# EAGLE design 2017MXP board (EAGLE 7.1.0)
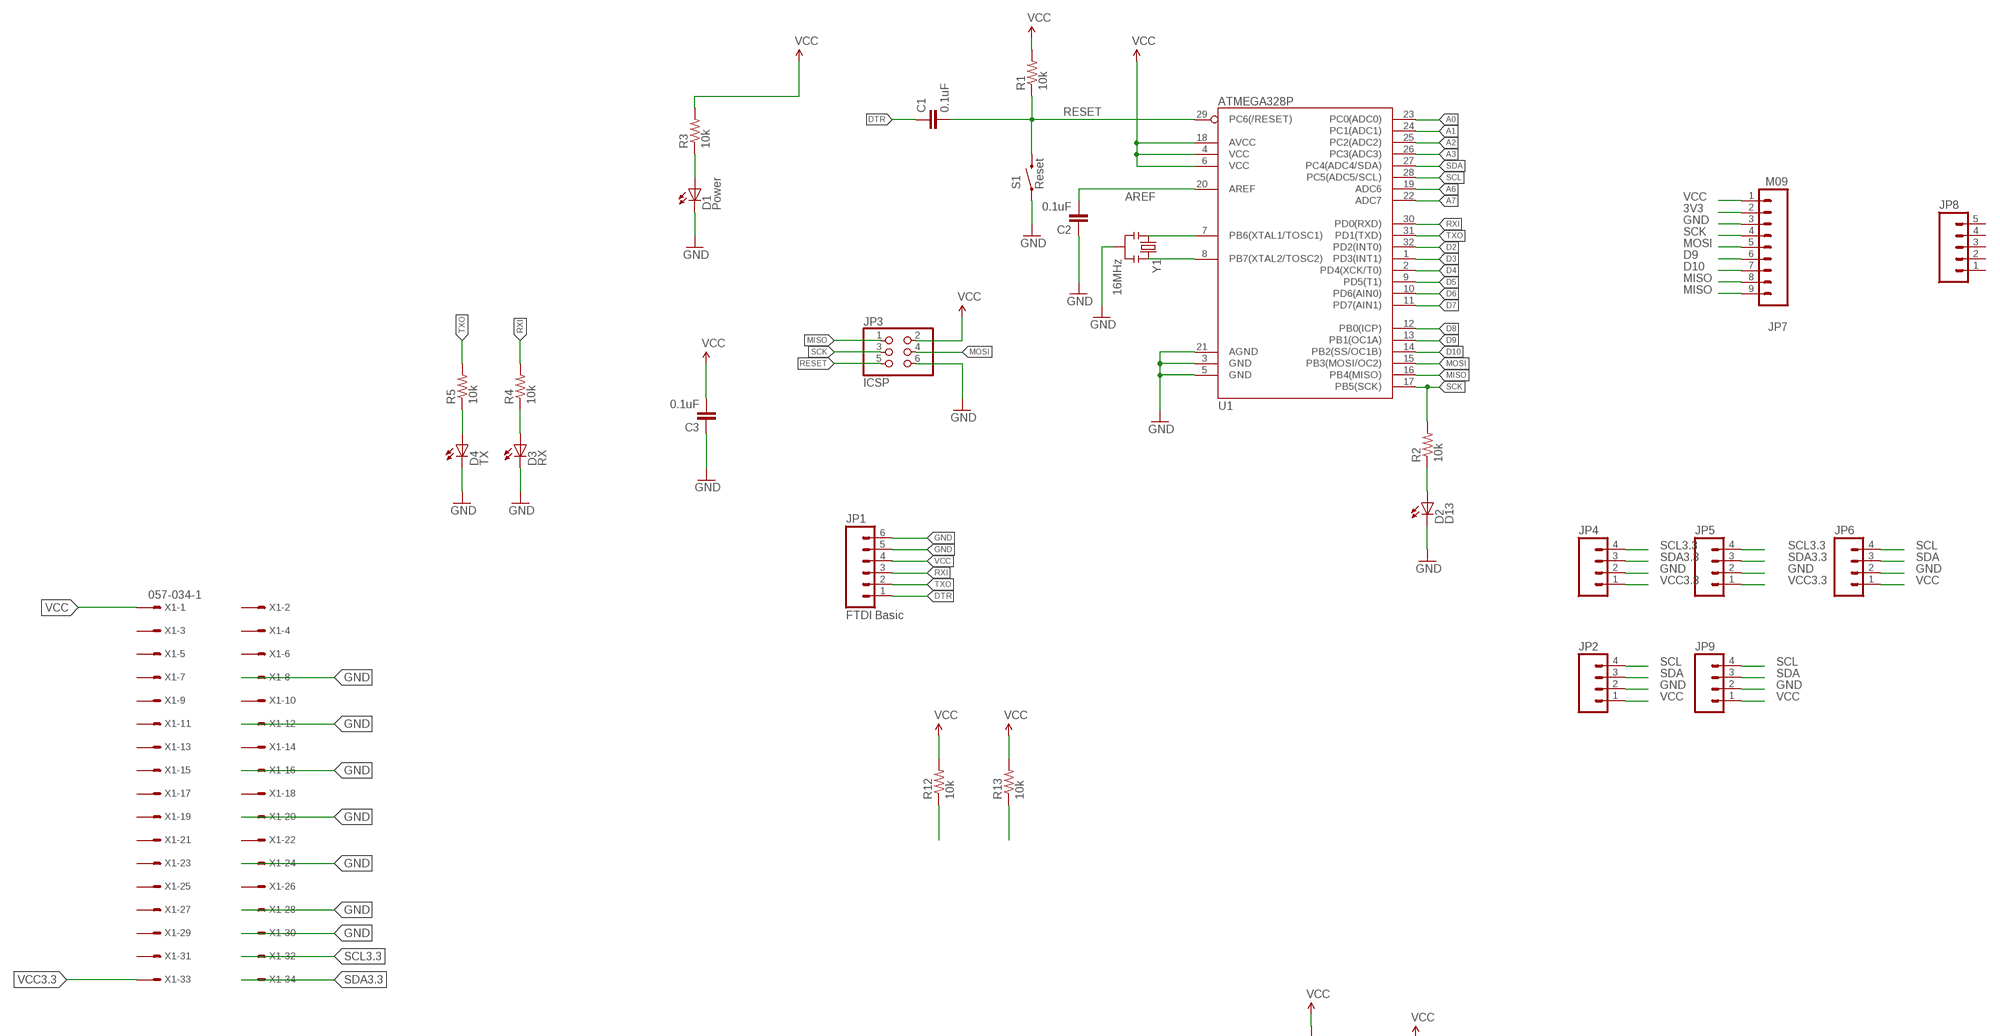
[diagram p0: schematic, sheet 1, part 1 of 2]
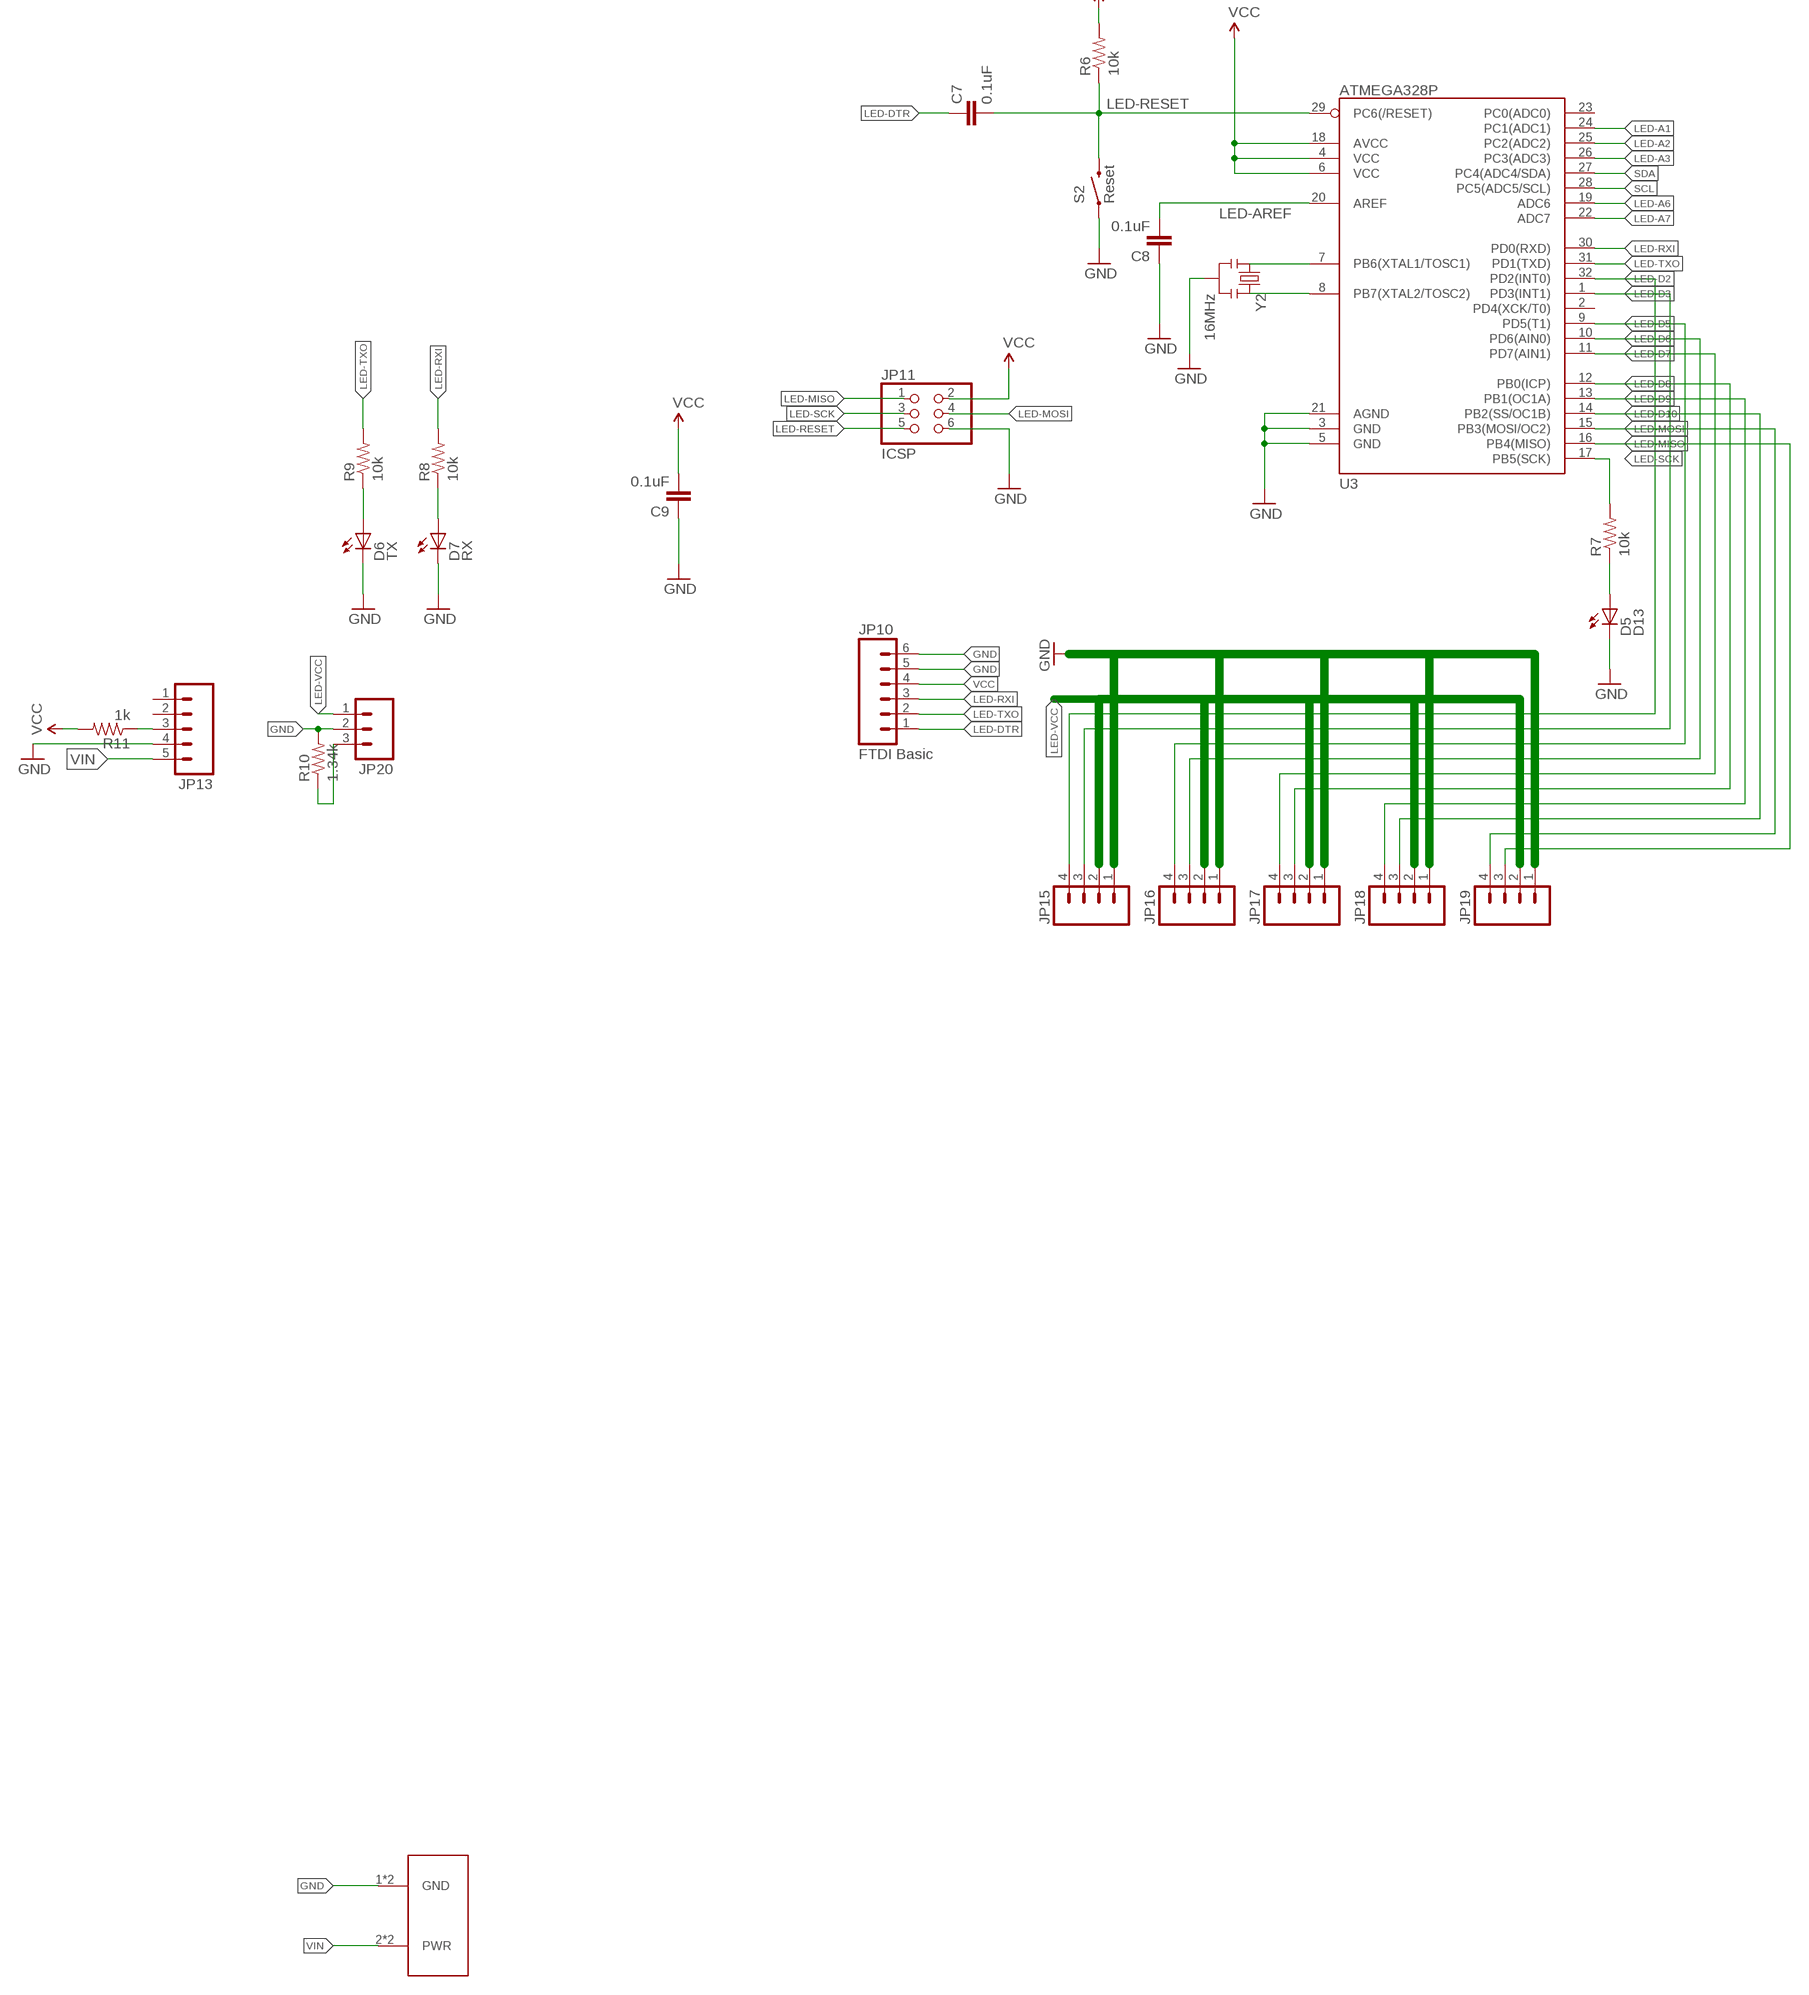
[diagram p1: schematic, sheet 1, part 2 of 2]

## Parts
C1  0.1uF  CAP0603-CAP  [0603-CAP]
C2  0.1uF  CAP0603-CAP  [0603-CAP]
C3  0.1uF  CAP0603-CAP  [0603-CAP]
C7  0.1uF  CAP0603-CAP  [0603-CAP]
C8  0.1uF  CAP0603-CAP  [0603-CAP]
C9  0.1uF  CAP0603-CAP  [0603-CAP]
D1  Power  LED-RED0603  [LED-0603]
D2  D13  LED-RED0603  [LED-0603]
D3  RX  LED-GREEN0603  [LED-0603]
D4  TX  LED-RED0603  [LED-0603]
D5  D13  LED-RED0603  [LED-0603]
D6  TX  LED-RED0603  [LED-0603]
D7  RX  LED-GREEN0603  [LED-0603]
JP1  FTDI Basic  M06SIP  [1X06]
JP2  M04PTH  [1X04]
JP3  ICSP  PINHD-2X3  [2X03]
JP4  M04PTH  [1X04]
JP5  M04PTH  [1X04]
JP6  M04PTH  [1X04]
JP7  M09  [1X09]
JP8  M05PTH  [1X05]
JP9  M04PTH  [1X04]
JP10  FTDI Basic  M06SIP  [1X06]
JP11  ICSP  PINHD-2X3  [2X03]
JP13  M05PTH  [1X05]
JP15  M04PTH  [1X04]
JP16  M04PTH  [1X04]
JP17  M04PTH  [1X04]
JP18  M04PTH  [1X04]
JP19  M04PTH  [1X04]
JP20  M03PTH  [1X03]
R1  10k  RESISTOR0603-RES  [0603-RES]
R2  10k  RESISTOR0603-RES  [0603-RES]
R3  10k  RESISTOR0603-RES  [0603-RES]
R4  10k  RESISTOR0603-RES  [0603-RES]
R5  10k  RESISTOR0603-RES  [0603-RES]
R6  10k  RESISTOR0603-RES  [0603-RES]
R7  10k  RESISTOR0603-RES  [0603-RES]
R8  10k  RESISTOR0603-RES  [0603-RES]
R9  10k  RESISTOR0603-RES  [0603-RES]
R10  1.34k  RESISTORAXIAL-0.3  [AXIAL-0.3]
R11  1k  RESISTORAXIAL-0.3  [AXIAL-0.3]
R12  10k  RESISTOR0603-RES  [0603-RES]
R13  10k  RESISTOR0603-RES  [0603-RES]
S1  Reset  SWITCH-MOMENTARY-2SMD  [TACTILE_SWITCH_SMD]
S2  Reset  SWITCH-MOMENTARY-2SMD  [TACTILE_SWITCH_SMD]
U1  ATMEGA328P  ATMEGA328_SMT  [TQFP32-08]
U3  ATMEGA328P  ATMEGA328_SMT  [TQFP32-08]
U$2  LSF-SMT  [LSF-SMT]
X1  057-034-1  [057-034-1]
Y1  16MHz  RESONATOR16MHZ  [RESONATOR-SMD]
Y2  16MHz  RESONATOR16MHZ  [RESONATOR-SMD]

## Nets
3V3: JP7.2
A0: U1.23(PC0(ADC0))
A1: U1.24(PC1(ADC1))
A2: U1.25(PC2(ADC2))
A3: U1.26(PC3(ADC3))
A6: U1.19(ADC6)
A7: U1.22(ADC7)
AREF: C2.2 U1.20(AREF)
D2: U1.32(PD2(INT0))
D3: U1.1(PD3(INT1))
D4: U1.2(PD4(XCK/T0))
D5: U1.9(PD5(T1))
D6: U1.10(PD6(AIN0))
D7: U1.11(PD7(AIN1))
D8: U1.12(PB0(ICP))
D9: JP7.6 U1.13(PB1(OC1A))
D10: JP7.7 U1.14(PB2(SS/OC1B))
DTR: C1.1 JP1.1
GND: C2.1 C3.1 C8.1 C9.1 D1.C D2.C D3.C D4.C D5.C D6.C D7.C JP1.5 JP1.6 JP2.2 JP3.6 JP4.2 JP5.2 JP6.2 JP7.3 JP9.2 JP10.5 JP10.6 JP11.6 JP13.4 JP15.1 JP16.1 JP17.1 JP18.1 JP19.1 JP20.2 R10.P$2 S1.1 S2.1 U1.3(GND) U1.5(GND) U1.21(AGND) U3.3(GND) U3.5(GND) U3.21(AGND) U$2.1(GND) U$2.1-2(GND) X1.8 X1.12 X1.16 X1.20 X1.24 X1.28 X1.30 Y1.2 Y2.2
LED-A1: U3.24(PC1(ADC1))
LED-A2: U3.25(PC2(ADC2))
LED-A3: U3.26(PC3(ADC3))
LED-A6: U3.19(ADC6)
LED-A7: U3.22(ADC7)
LED-AREF: C8.2 U3.20(AREF)
LED-D2: JP15.4 U3.32(PD2(INT0))
LED-D3: JP15.3 U3.1(PD3(INT1))
LED-D5: JP16.4 U3.9(PD5(T1))
LED-D6: JP16.3 U3.10(PD6(AIN0))
LED-D7: JP17.4 U3.11(PD7(AIN1))
LED-D8: JP17.3 U3.12(PB0(ICP))
LED-D9: JP18.4 U3.13(PB1(OC1A))
LED-D10: JP18.3 U3.14(PB2(SS/OC1B))
LED-DTR: C7.1 JP10.1
LED-MISO: JP11.1 JP19.3 U3.16(PB4(MISO))
LED-MOSI: JP11.4 JP19.4 U3.15(PB3(MOSI/OC2))
LED-RESET: C7.2 JP11.5 R6.1 S2.3 U3.29(PC6(/RESET))
LED-RXI: JP10.3 R8.2 U3.30(PD0(RXD))
LED-SCK: JP11.3 R7.2 U3.17(PB5(SCK))
LED-TXO: JP10.2 R9.2 U3.31(PD1(TXD))
LED-VCC: JP15.2 JP16.2 JP17.2 JP18.2 JP19.2 JP20.1
MISO: JP3.1 JP7.8 JP7.9 U1.16(PB4(MISO))
MOSI: JP3.4 JP7.5 U1.15(PB3(MOSI/OC2))
N$1: U1.7(PB6(XTAL1/TOSC1)) Y1.1
N$2: U1.8(PB7(XTAL2/TOSC2)) Y1.3
N$3: D1.A R3.1
N$4: D2.A R2.1
N$5: D3.A R4.1
N$6: D4.A R5.1
N$7: U3.7(PB6(XTAL1/TOSC1)) Y2.1
N$8: U3.8(PB7(XTAL2/TOSC2)) Y2.3
N$9: D5.A R7.1
N$10: D6.A R9.1
N$11: D7.A R8.1
N$12: JP20.3 R10.P$1
N$14: JP13.3 R11.P$1
RESET: C1.2 JP3.5 R1.1 S1.3 U1.29(PC6(/RESET))
RXI: JP1.3 R4.2 U1.30(PD0(RXD))
SCK: JP3.3 JP7.4 R2.2 U1.17(PB5(SCK))
SCL: JP2.4 JP6.4 JP9.4 R13.1 U1.28(PC5(ADC5/SCL)) U3.28(PC5(ADC5/SCL))
SCL3.3: JP4.4 JP5.4 X1.32
SDA: JP2.3 JP6.3 JP9.3 R12.1 U1.27(PC4(ADC4/SDA)) U3.27(PC4(ADC4/SDA))
SDA3.3: JP4.3 JP5.3 X1.34
TXO: JP1.2 R5.2 U1.31(PD1(TXD))
VCC: C3.2 C9.2 JP1.4 JP2.1 JP3.2 JP6.1 JP7.1 JP9.1 JP10.4 JP11.2 R1.2 R3.2 R6.2 R11.P$2 R12.2 R13.2 U1.4(VCC) U1.6(VCC) U1.18(AVCC) U3.4(VCC) U3.6(VCC) U3.18(AVCC) X1.1
VCC3.3: JP4.1 JP5.1 X1.33
VIN: JP13.5 U$2.2(PWR) U$2.2-2(PWR)
Unconnected: JP8.1 JP8.2 JP8.3 JP8.4 JP8.5 JP13.1 JP13.2 U3.2(PD4(XCK/T0)) U3.23(PC0(ADC0)) X1.2 X1.3 X1.4 X1.5 X1.6 X1.7 X1.9 X1.10 X1.11 X1.13 X1.14 X1.15 X1.17 X1.18 X1.19 X1.21 X1.22 X1.23 X1.25 X1.26 X1.27 X1.29 X1.31

## Library data of the parts
C1-C3 C7-C9 = SparkFun-Passives:CAP: Capacitor Standard 0603 ceramic capacitor, and 0.1" leaded capacitor.
D1 D2 D4-D6 = SparkFun-LED:LED-RED: Assorted Red LEDs LilyPad 1206- DIO-09912 1206- DIO-00809 0603- DIO-00819; PROD_ID: DIO-00819; VALUE: RED
D3 D7 = SparkFun-LED:LED-GREEN: Various green LEDs Green LEDs used in SFE Production 0603- DIO-00821 LARGE- DIO-00862 LILYPAD- DIO-09910; PROD_ID: DIO-00821; VALUE: GREEN
JP1 JP10 = SparkFun-Connectors:M06: Header 6 Standard 6-pin 0.1" header. Use with straight break away headers (SKU : PRT-00116), right angle break away headers (PRT-00553), swiss pins (PRT-00743), machine pins (PRT-00117), and female headers (PRT-00115). Molex polarized connector foot print use with SKU : PRT-08094 with associated crimp pins and housings. NOTES ON THE VARIANTS LOCK and LOCK_LONGPADS... This footprint was designed to help hold the alignment of a through-hole component (i.e. 6-pin header) while soldering it into place. You may notice that each hole has been shifted either up or down by 0.005 of an inch from it's more standard position (which is a perfectly straight line). This slight alteration caused the pins (the squares in the middle) to touch the edges of the holes. Because they are alternating, it causes a "brace" to hold the component in place. 0.005 has proven to be the perfect amount of "off-center" position when using our standard breakaway headers. Although looks a little odd when you look at the bare footprint, once you have a header in there, the alteration is very hard to notice. Also,if you push a header all the way into place, it is covered up entirely on the bottom side. This idea of altering the position of holes to aid alignment will be further integrated into the Sparkfun Library for other footprints. It can help hold any component with 3 or more connection pins.
JP2 JP4-JP6 JP9 JP15-JP19 = SparkFun-Connectors:M04: Header 4 Standard 4-pin 0.1" header. Use with straight break away headers (SKU : PRT-00116), right angle break away headers (PRT-00553), swiss pins (PRT-00743), machine pins (PRT-00117), and female headers (PRT-00115). Molex polarized connector foot print use with SKU : PRT-08231 with associated crimp pins and housings. 1MM SMD Version SKU: PRT-10208
JP3 JP11 = SparkFun-Connectors:PINHD-2X3: PIN HEADER
JP7 = SparkFun-Connectors:M09: Header 9 Standard 9-pin 0.1" header. Use with straight break away headers (SKU : PRT-00116), right angle break away headers (PRT-00553), swiss pins (PRT-00743), machine pins (PRT-00117), and female headers (PRT-00115).
JP8 JP13 = SparkFun-Connectors:M05: Header 5 Standard 5-pin 0.1" header. Use with straight break away headers (SKU : PRT-00116), right angle break away headers (PRT-00553), swiss pins (PRT-00743), machine pins (PRT-00117), and female headers (PRT-00115). Molex polarized connector foot print use with SKU : PRT-08230 with associated crimp pins and housings.
JP20 = SparkFun-Connectors:M03: Header 3 Standard 3-pin 0.1" header. Use with straight break away headers (SKU : PRT-00116), right angle break away headers (PRT-00553), swiss pins (PRT-00743), machine pins (PRT-00117), and female headers (PRT-00115). Molex polarized connector foot print use with SKU : PRT-08232 with associated crimp pins and housings.
R1-R9 R12 R13 = SparkFun-Passives:RESISTOR: Resistor Basic schematic elements and footprints for 0603, 1206, and PTH resistors.
R10 R11 = SparkFun-Resistors:RESISTOR: Resistor Basic schematic elements and footprints for 0603, 1206, and PTH resistors.
S1 S2 = SparkFun-Electromechanical:SWITCH-MOMENTARY-2: Various NO switches- pushbuttons, reed, etc; PROD_ID: SWCH-08247
U1 U3 = SparkFun-DigitalIC:ATMEGA328_SMT: 32-Pin Atmega328 part Commonly used on Arduino compatible boards Available in QFP and QFN packages TQFP is IC-09069 QFN is non-stock; PROD_ID: IC-09069
U$2 = LSF-SMT:LSF-SMT
X1 = con-panduit:057-034-: CONNECTOR 34-pin series 057 contact pc board low profile headers; OC_FARNELL: unknown; OC_NEWARK: unknown
Y1 Y2 = SparkFun-FreqCtrl:RESONATOR: Resonator Small SMD resonator. Used, eg, on the Arduino Pro/ Pro Mini boards. 8MHz- XTAL-08895 16MHz- XTAL-08900; PROD_ID: XTAL-08900

## Board
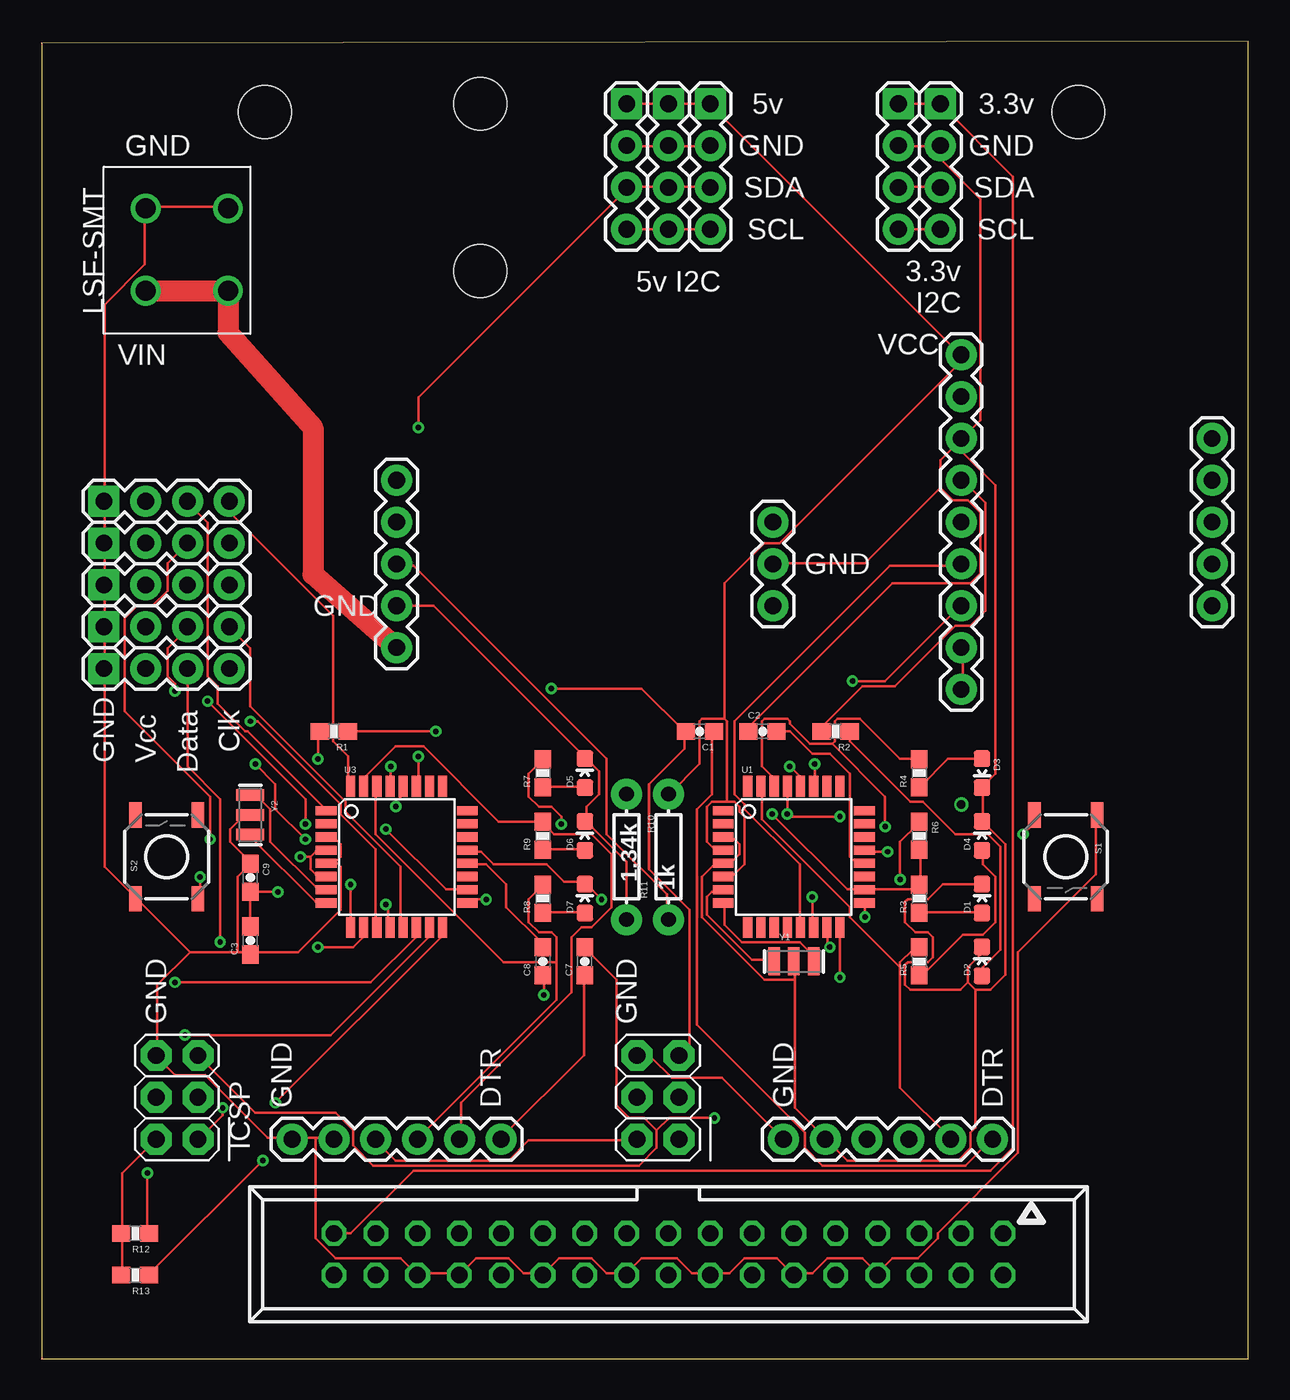
[diagram p2: board, top side]
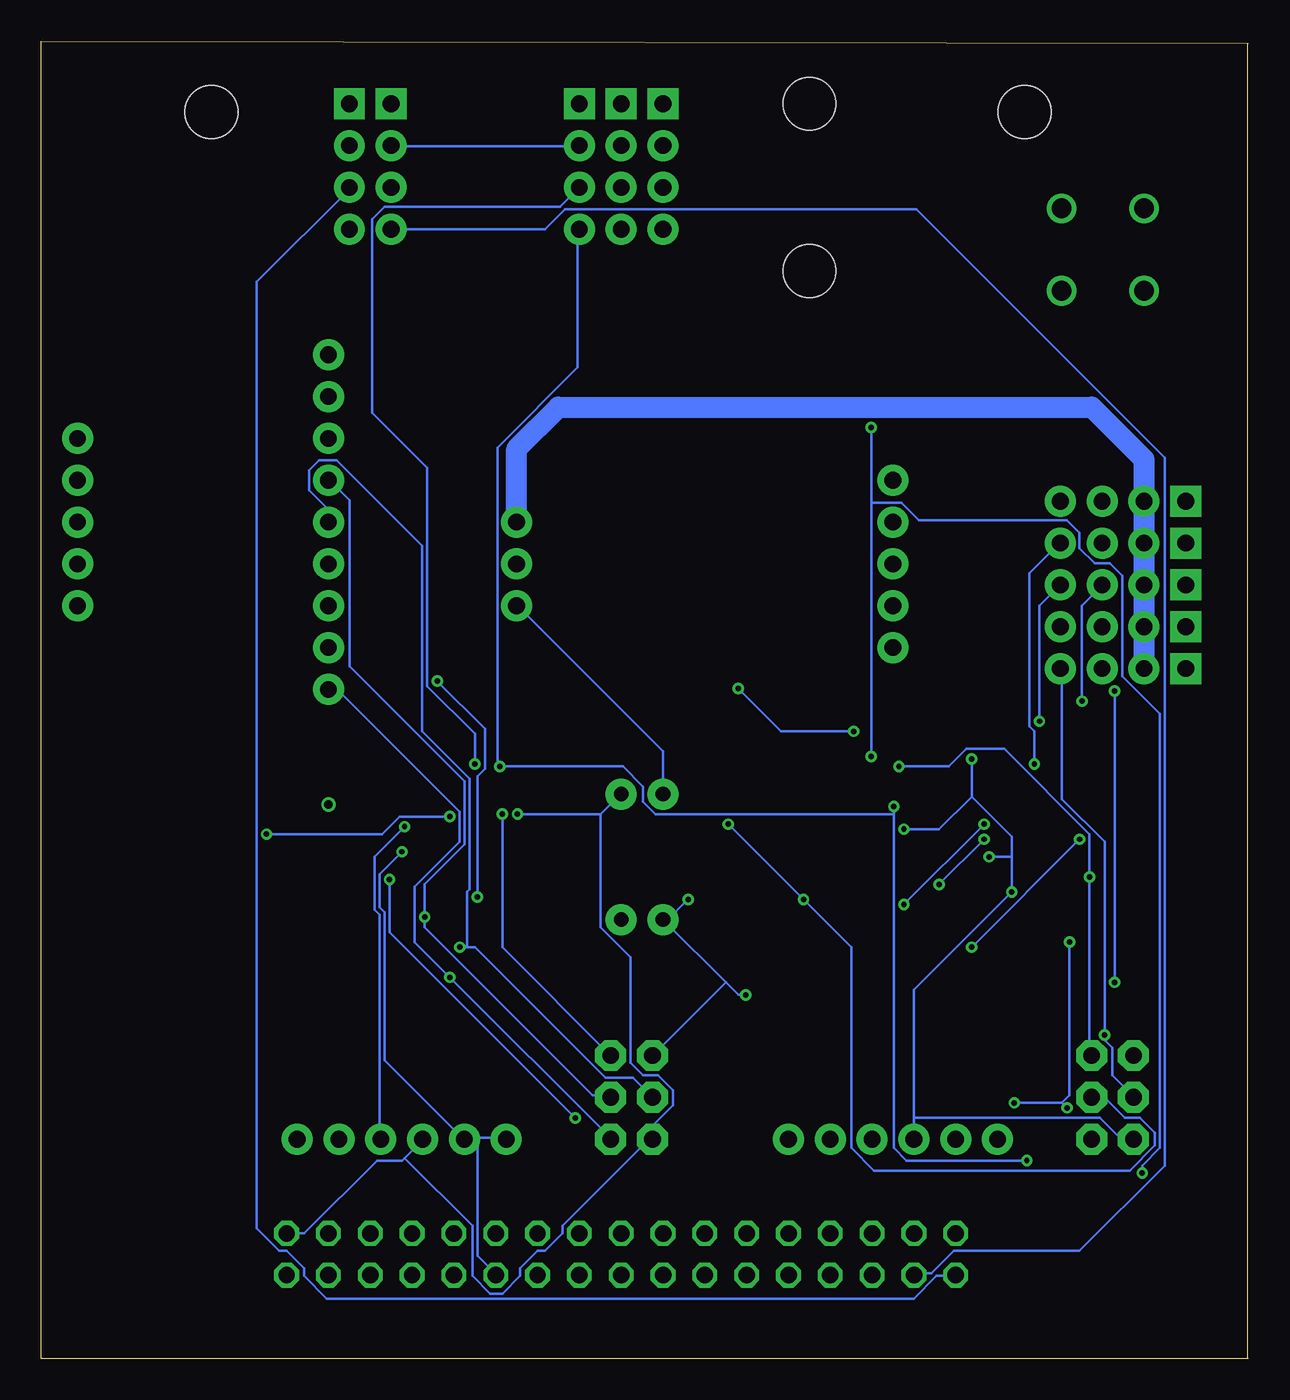
[diagram p3: board, bottom side, seen from below]

Size 73.33 x 80 mm. Coordinates in mm from the lower left corner, seen from the top.
Outline: 0,0 0.05,0
Outline: 0.05,0 73.33,0 73.33,80 0,79.87
Outline: 0.05,0 0.05,79.87
Copper layers (1*16): Top 0.0356mm / dielectric 1.5011mm / Bottom 0.0356mm
Design rules "LaenPCBOrder": minimum track width 6mil, minimum drill 13mil, track to track 6mil, track to pad 6mil, pad to pad 6mil, via to via 6mil, smd to smd 6mil, copper to edge 15mil, drill to drill 6mil, minimum pad ring 7mil, minimum via ring 7mil, stop-mask expansion 3mil, vias tented up to drill 0mil, thermal gap 10mil
Holes 3.2 mm at 13.59,75.69 62.99,75.69 26.67,66.04 26.67,76.2

### Footprints (pad centres in the part's own frame; a part is rotated, then mirrored left to right if it is on the bottom)
0603-CAP = smd 1.1 x 1: 1 -0.85,0; 2 0.85,0
LED-0603 = smd 1 x 1: A 0,-0.877; C 0,0.877
1X06 = drill 1.016 pad 1.88: 1 0,0; 2 2.54,0; 3 5.08,0; 4 7.62,0; 5 10.16,0; 6 12.7,0
1X04 = drill 1.016 pad 1.88 square: 1 0,0 | drill 1.016 pad 1.88: 2 2.54,0; 3 5.08,0; 4 7.62,0
2X03 = drill 1.016 pad 1.88 octagon: 1 -2.54,-1.27; 2 -2.54,1.27; 3 0,-1.27; 4 0,1.27; 5 2.54,-1.27; 6 2.54,1.27
1X09 = drill 1.016 pad 1.88: 1 0,0; 2 2.54,0; 3 5.08,0; 4 7.62,0; 5 10.16,0; 6 12.7,0; 7 15.24,0; 8 17.78,0; 9 20.32,0
1X05 = drill 1.016 pad 1.88: 1 0,0; 2 2.54,0; 3 5.08,0; 4 7.62,0; 5 10.16,0
1X03 = drill 1.016 pad 1.88: 1 0,0; 2 2.54,0; 3 5.08,0
0603-RES = smd 1.1 x 1: 1 -0.85,0; 2 0.85,0
AXIAL-0.3 = drill 0.9 pad 1.88: P$1 -3.81,0; P$2 3.81,0
TACTILE_SWITCH_SMD = smd 1.524 x 0.762: 1 -2.54,1.905; 2 2.54,1.905; 3 -2.54,-1.905; 4 2.54,-1.905
TQFP32-08 = smd 1.27 x 0.559: 1 -4.293,2.8; 2 -4.293,2; 3 -4.293,1.2; 4 -4.293,0.4; 5 -4.293,-0.4; 6 -4.293,-1.2; 7 -4.293,-2; 8 -4.293,-2.8; 17 4.293,-2.8; 18 4.293,-2; 19 4.293,-1.2; 20 4.293,-0.4; 21 4.293,0.4; 22 4.293,1.2; 23 4.293,2; 24 4.293,2.8 | smd 0.559 x 1.27: 9 -2.8,-4.293; 10 -2,-4.293; 11 -1.2,-4.293; 12 -0.4,-4.293; 13 0.4,-4.293; 14 1.2,-4.293; 15 2,-4.293; 16 2.8,-4.293; 25 2.8,4.293; 26 2,4.293; 27 1.2,4.293; 28 0.4,4.293; 29 -0.4,4.293; 30 -1.2,4.293; 31 -2,4.293; 32 -2.8,4.293
LSF-SMT = drill 1.199: 1 0,5.004; 1-2 0,0; 2 5.004,5.004; 2-2 5.004,0
057-034-1 = drill 1 octagon: 1 -20.32,-1.27; 2 -20.32,1.27; 3 -17.78,-1.27; 4 -17.78,1.27; 5 -15.24,-1.27; 6 -15.24,1.27; 7 -12.7,-1.27; 8 -12.7,1.27; 9 -10.16,-1.27; 10 -10.16,1.27; 11 -7.62,-1.27; 12 -7.62,1.27; 13 -5.08,-1.27; 14 -5.08,1.27; 15 -2.54,-1.27; 16 -2.54,1.27; 17 0,-1.27; 18 0,1.27; 19 2.54,-1.27; 20 2.54,1.27; 21 5.08,-1.27; 22 5.08,1.27; 23 7.62,-1.27; 24 7.62,1.27; 25 10.16,-1.27; 26 10.16,1.27; 27 12.7,-1.27; 28 12.7,1.27; 29 15.24,-1.27; 30 15.24,1.27; 31 17.78,-1.27; 32 17.78,1.27; 33 20.32,-1.27; 34 20.32,1.27
RESONATOR-SMD = smd 0.7 x 1.7: 1 -1.2,0; 2 0,0; 3 1.2,0

### Placement (x,y rotation side)
C1  40.01,38.1 180 top
C2  43.81,38.1 0 top
C3  12.7,25.4 90 top
C7  33.02,24.13 90 top
C8  30.48,24.13 90 top
C9  12.7,29.21 270 top
D1  57.15,27.94 0 top
D2  57.15,24.13 0 top
D3  57.15,35.56 180 top
D4  57.15,31.75 0 top
D5  33.02,35.56 0 top
D6  33.02,31.75 0 top
D7  33.02,27.94 0 top
JP1  57.78,13.34 180 top
JP2  35.56,76.2 270 top
JP3  37.47,15.88 90 top
JP4  54.61,76.2 270 top
JP5  52.07,76.2 270 top
JP6  40.64,76.2 270 top
JP7  55.88,60.96 270 top
JP8  71.12,55.88 270 top
JP9  38.1,76.2 270 top
JP10  27.94,13.34 180 top
JP11  8.26,15.88 90 top
JP13  21.59,53.34 270 top
JP15  3.81,52.07 0 top
JP16  3.81,49.53 0 top
JP17  3.81,46.99 0 top
JP18  3.81,44.45 0 top
JP19  3.81,41.91 0 top
JP20  44.45,50.8 270 top
R1  17.78,38.1 180 top
R2  48.26,38.1 180 top
R3  53.34,27.94 90 top
R4  53.34,35.56 90 top
R5  53.34,24.13 90 top
R6  53.34,31.75 270 top
R7  30.48,35.56 90 top
R8  30.48,27.94 90 top
R9  30.48,31.75 90 top
R10  35.56,30.48 270 top
R11  38.1,30.48 90 top
R12  5.71,7.62 180 top
R13  5.71,5.08 180 top
S1  62.23,30.48 270 top
S2  7.62,30.48 90 top
U1  45.72,30.48 0 top
U3  21.59,30.48 0 top
U$2  6.35,69.85 270 top
X1  38.1,6.35 180 top
Y1  45.72,24.13 0 top
Y2  12.7,33.02 270 top

### Tracks (layer width: path | path; a pad name or v marks a point on that pad's centre or on a via)
AREF
  Top 0.152: C2.2 45.47,38.1 46.84,36.73 47.9,36.73 49.12,35.51 49.12,30.48 49.43,30.18 49.89,30.18 U1.20
D9
  Top 0.152: U1.13 46.08,26.21 46.08,30.02 42.72,33.38 42.72,33.68 42.11,34.29 42.11,38.71 51.56,48.16 55.83,48.16 JP7.6
D10  (via drill 0.33)
  Top 0.152: v46.84,28.04 46.84,26.21 U1.14 | v49.28,41.15 51.26,41.15 55.83,45.72 JP7.7
  Bottom 0.152: v46.84,28.04 46.84,35.36 46.38,35.81 46.38,38.25 v49.28,41.15
DTR
  Top 0.152: C1.1 40.74,38.1 40.74,34.29 39.83,33.38 39.83,20.27 46.38,13.72 46.38,12.8 47.45,11.73 56.13,11.73 57.66,13.26 JP1.1
GND  (via drill 0.33)
  Top 0.152: 54.61,73.61 52.17,73.61 JP5.2 | JP2.2 35.56,73.61 38,73.61 JP9.2 38.15,73.61 40.59,73.61 JP6.2 | 54.61,52.88 55.37,52.12 56.29,52.12 57.05,51.36 57.05,47.7 56.44,47.09 51.71,47.09 43.03,38.41 43.03,38.1 C2.1 | 54.61,52.88 54.61,54.56 55.52,55.47 | 55.52,55.47 55.83,55.78 JP7.3 | 54.61,52.88 50.04,48.31 44.55,48.31 JP20.2 | 54.61,73.61 54.61,72.85 57.05,70.41 57.05,57 55.98,55.93 JP7.3 | 54.61,73.61 JP4.2 | U$2.1 11.33,69.95 6.45,69.95 U$2.1-2 6.3,69.8 6.3,66.45 3.86,64.01 3.86,52.12 JP15.1 3.86,51.97 3.86,49.53 | 17.88,30.18 17.42,30.18 U3.5 17.88,30.18 | 17.88,30.18 18.19,30.48 18.19,31.24 17.88,31.55 17.42,31.55 U3.3 | 3.86,41.91 3.86,44.35 JP18.1 3.86,44.5 3.86,46.94 JP17.1 3.86,47.09 3.86,49.53 | 3.86,49.53 JP16.1 | U3.21 25.96,30.79 26.72,30.79 27.48,30.02 30.68,30.02 31.75,28.96 32.97,28.96 D7.C 33.12,28.8 v34.04,27.89 | v30.53,22.1 30.53,23.16 C8.1 | R10.P$2 35.56,30.18 33.12,32.61 D6.C 33.12,32.77 33.12,33.53 33.88,34.29 33.88,35.66 33.12,36.42 D5.C 32.97,36.58 23.83,45.72 JP13.4 | 56.29,22.86 56.29,23.77 57.05,24.54 57.05,24.99 D2.C | 56.74,22.4 56.29,22.86 | 56.74,22.4 57.66,22.4 58.57,23.32 58.57,31.24 57.2,32.61 D4.C 57.2,32.77 57.2,34.59 D3.C 57.2,34.75 57.96,35.51 57.96,53.03 55.52,55.47 | 56.29,22.86 55.83,22.4 52.78,22.4 52.48,22.71 52.48,23.93 52.63,24.08 53.85,24.08 54.15,24.38 54.15,25.6 53.85,25.91 53.09,25.91 52.48,26.52 52.48,27.74 52.63,27.89 53.85,27.89 54.76,28.8 57.05,28.8 D1.C | U1.3 41.5,31.55 42.11,31.55 42.42,31.24 42.42,30.63 41.96,30.18 41.5,30.18 U1.5 41.35,30.02 40.89,30.02 40.13,29.26 40.13,26.82 43.94,23.01 45.77,23.01
  Top 0.152: v51.41,30.79 50.04,30.79 U1.21 | 45.77,23.01 45.77,15.24 47.6,13.41 JP1.5 47.75,13.26 48.97,12.04 55.68,12.04 56.44,12.8 56.44,13.72 56.74,14.02 56.74,22.4 | 45.77,23.01 45.77,24.08 Y1.2 | 16.66,13.41 17.73,13.41 JP10.5 | 16.66,13.41 15.29,13.41 JP10.6 15.14,13.41 13.77,13.41 9.96,17.22 8.13,17.22 7.06,18.29 JP11.6 7.06,18.44 7.06,22.71 9.04,24.69 | 9.04,24.69 11.94,24.69 | 11.94,24.69 12.7,24.69 | 9.04,24.69 5.84,27.89 S2.1 5.69,28.04 3.86,29.87 3.86,41.91 | 35.56,5.18 34.34,5.18 33.43,6.1 31.45,6.1 30.53,5.18 X1.24 30.38,5.18 29.31,5.18 28.4,6.1 26.42,6.1 X1.28 25.35,5.18 22.91,5.18 X1.30 21.84,6.1 17.88,6.1 16.66,7.32 16.66,13.41 | 35.56,5.18 36.47,6.1 38.61,6.1 39.52,5.18 40.59,5.18 X1.16 40.74,5.18 41.81,5.18 42.72,6.1 44.7,6.1 X1.12 45.77,5.18 46.84,5.18 47.75,6.1 49.89,6.1 50.8,5.18 | 35.56,5.18 X1.20 | 50.8,5.18 51.71,6.1 53.24,6.1 54.46,7.32 54.46,7.62 59.33,12.5 59.33,24.69 64.06,29.41 64.06,32.92 S1.1 | 50.8,5.18 X1.8 | JP1.6 41.35,17.07 38.3,17.07 37.08,18.29 36.32,18.29 JP3.6 | 3.86,41.91 JP19.1 | 55.52,55.47 JP7.3 | Y2.2 12.7,32.92 12.24,32.92 11.48,32.16 11.48,31.39 12.7,30.18 C9.1 12.7,30.02 11.94,29.26 11.94,24.69 | 17.88,30.18 18.19,29.87 18.19,27.28 15.6,24.69 12.7,24.69 | 12.7,24.69 C3.1
  Bottom 0.152: JP5.2 52.02,73.61 40.74,73.61 JP6.2 | v30.53,22.1 30.99,22.1 31.75,22.86 | 35.41,26.52 31.75,22.86 | 31.75,22.86 JP3.6 | 35.41,26.52 v34.04,27.89 | 35.41,26.52 R10.P$2 | v51.41,30.79 52.78,29.41 52.78,27.43 52.48,27.13 52.48,18.14 47.75,13.41 JP1.5 | 46.84,13.41 47.6,13.41 JP1.5 | 46.84,13.41 45.16,13.41 JP1.6 | 46.84,13.41 46.84,6.25 45.77,5.18 X1.12 | 46.84,13.41 JP1.5
LED-AREF
  Top 0.152: C8.2 30.38,24.99 30.38,25.3 28.25,27.43 28.25,28.8 27.03,30.02 25.96,30.02 U3.20
LED-D2
  Top 0.152: U3.32 18.64,34.9 18.64,36.58 17.73,37.49 17.73,45.11 11.48,51.36 11.48,51.97 JP15.4
LED-D3
  Top 0.152: U3.1 17.27,33.38 12.55,38.1 12.39,38.1 10.72,39.78 10.72,40.84 10.11,41.45 10.11,50.75 8.89,51.97 JP15.3
LED-D5  (via drill 0.33)
  Top 0.152: v18.8,28.8 18.8,26.21 U3.9 | v16.05,31.55 14.22,33.38 14.22,34.9 v13.01,36.12
  Bottom 0.152: v16.05,31.55 v18.8,28.8 | v13.01,36.12 13.01,38.1 13.31,38.41 13.31,47.7 11.48,49.53 JP16.4
LED-D6  (via drill 0.33)
  Top 0.152: v16.81,24.99 18.95,24.99 19.56,25.6 19.56,26.06 U3.10 | v10.26,31.55 10.26,34.14 5.08,39.32 5.08,44.96 5.84,45.72 6.76,45.72 7.67,46.63 7.67,48.31 JP16.3
  Bottom 0.152: v10.26,31.55 v16.81,24.99
LED-D7  (via drill 0.33)
  Top 0.152: v12.7,38.71 13.16,38.71 18.19,33.68 18.19,33.07 20.32,30.94 20.32,26.21 U3.11
  Bottom 0.152: v12.7,38.71 12.7,45.72 JP17.4
LED-D8  (via drill 0.33)
  Top 0.152: v20.93,27.58 21.08,27.43 21.08,26.21 U3.12 | v16.05,32.46 16.05,33.98 v10.11,39.93
  Bottom 0.152: v16.05,32.46 v20.93,27.58 | v10.11,39.93 10.11,45.72 8.89,46.94 JP17.3
LED-D9
  Top 0.152: U3.13 21.84,26.21 21.84,29.87 18.49,33.22 18.49,33.83 12.7,39.62 12.7,43.13 11.48,44.35 JP18.4
LED-D10  (via drill 0.33)
  Top 0.152: v8.13,22.86 20.02,22.86 22.76,25.6 22.76,26.06 U3.14 | v8.13,40.54 8.13,41 7.67,41.45 7.67,43.13 8.89,44.35 JP18.3
  Bottom 0.152: v8.13,40.54 v8.13,22.86
LED-DTR
  Top 0.152: C7.1 32.97,23.16 32.97,18.44 27.94,13.41 JP10.1
LED-MISO  (via drill 0.33)
  Top 0.152: v14.22,15.54 24.28,25.6 24.28,26.06 U3.16 | v11.02,15.24 11.02,14.78 9.65,13.41 JP11.1 | JP19.3 8.89,35.97 10.87,33.98 v10.87,25.3
  Bottom 0.152: 11.33,15.54 v14.22,15.54 | v11.02,15.24 11.33,15.54 | v10.87,25.3 10.87,16 11.33,15.54
LED-MOSI  (via drill 0.33)
  Top 0.152: v8.74,19.66 17.58,19.66 23.52,25.6 23.52,26.06 U3.15
  Bottom 0.152: JP11.4 7.06,16 8.28,17.22 8.28,18.9 8.74,19.36 v8.74,19.66 8.74,31.39 11.33,33.98 11.33,41.91 JP19.4
LED-RESET  (via drill 0.33)
  Top 0.152: 37.39,13.87 36.63,14.63 35.71,14.63 34.95,15.39 34.95,23.01 33.12,24.84 C7.2 | 37.39,13.87 37.39,12.8 36.32,11.73 20.17,11.73 18.95,12.95 18.95,13.87 17.88,14.94 13.01,14.94 JP11.5 | v52.17,29.11 52.17,31.39 53.24,32.46 R6.1 | v40.89,14.63 38.15,14.63 37.39,13.87 | v21.23,35.97 21.23,34.9 U3.29 | v9.65,29.26 9.65,28.04 S2.3
  Bottom 0.152: v52.17,29.11 52.17,25.91 v40.89,14.63 | v21.23,35.97 18.19,35.97 17.12,37.03 14.83,37.03 9.65,31.85 v9.65,29.26 9.65,18.44 JP11.5
LED-RXI
  Top 0.152: 31.29,24.08 31.29,21.79 22.91,13.41 JP10.3 | 31.29,24.08 31.29,25.6 30.99,25.91 30.23,25.91 29.62,26.52 29.62,27.89 30.38,28.65 R8.2 | 31.29,24.08 28.09,24.08 20.32,31.85 20.32,34.75 U3.30
LED-SCK  (via drill 0.33)
  Top 0.152: v31.6,32.46 31.6,32.92 30.99,33.53 30.23,33.53 29.62,34.14 29.62,35.51 30.38,36.27 R7.2 | v27.03,27.89 26.11,27.89 25.96,27.74 U3.17
  Bottom 0.152: v31.6,32.46 v27.03,27.89 24.13,24.99 24.13,12.8 22.76,11.43 7.21,11.43 5.69,12.95 5.69,13.72 6.6,14.63 7.52,14.63 8.74,15.85 9.5,15.85 JP11.3
LED-TXO
  Top 0.152: U3.31 19.71,34.9 19.71,35.36 21.54,37.19 23.22,37.19 27.79,32.61 30.38,32.61 R9.2 30.53,32.46 31.14,31.85 33.43,31.85 34.65,30.63 34.65,27.43 33.43,26.21 32.82,26.21 32.21,25.6 32.21,22.25 25.5,15.54 25.5,13.41 JP10.2
LED-VCC
  Bottom 1.27: JP20.1 44.45,55.24 41.91,57.78 9.53,57.78 6.35,54.61 JP15.2 JP16.2 JP17.2 JP18.2 JP19.2
MISO  (via drill 0.33)
  Top 0.152: JP7.9 55.98,40.69 55.98,43.13 JP7.8 | v48.51,23.16 48.51,26.06 U1.16
  Bottom 0.152: JP3.1 38.76,13.41 v48.51,23.16 50.65,25.3 50.65,28.65 47.9,31.39 47.9,33.22 55.22,40.54 55.83,40.54 JP7.9
MOSI  (via drill 0.33)
  Top 0.152: v47.9,24.99 47.75,25.15 47.75,26.06 U1.15
  Bottom 0.152: 47.45,24.99 46.99,24.99 39.06,17.07 37.39,17.07 JP3.4 | 47.45,24.99 v47.9,24.99 | 47.45,24.99 47.45,28.35 47.3,28.5 47.3,35.2 50.19,38.1 50.19,49.38 55.37,54.56 56.44,54.56 57.05,53.95 57.05,52.73 55.98,51.66 55.98,50.9 JP7.5
N$1
  Top 0.152: U1.7 41.35,28.35 40.74,28.35 40.44,28.04 40.44,26.98 43.18,24.23 44.4,24.23 Y1.1
N$2
  Top 0.152: U1.8 41.5,27.58 41.5,26.36 42.57,25.3 46.08,25.3 46.84,24.54 46.84,24.23 Y1.3
N$3
  Top 0.152: D1.A 57.05,27.13 53.39,27.13 R3.1
N$4
  Top 0.152: D2.A 57.2,23.32 57.2,23.77 58.27,24.84 58.27,31.09 57.51,31.85 55.52,31.85 53.54,33.83 52.78,33.83 49.12,37.49 49.12,38.1 R2.1
N$5
  Top 0.152: D3.A 57.05,36.42 55.07,36.42 53.39,34.75 R4.1
N$6
  Top 0.152: D4.A 57.2,30.79 57.2,30.02 57.96,29.26 57.96,26.52 57.2,25.76 55.98,25.76 53.39,23.16 R5.1
N$7
  Top 0.152: U3.7 17.27,28.5 16.81,28.5 13.92,31.39 13.92,33.38 13.16,34.14 12.7,34.14 Y2.1
N$8
  Top 0.152: U3.8 17.27,27.74 16.66,27.74 12.7,31.7 Y2.3
N$9
  Top 0.152: D5.A 32.97,34.75 30.53,34.75 R7.1
N$10
  Top 0.152: D6.A 32.97,30.94 30.53,30.94 R9.1
N$11
  Top 0.152: D7.A 32.97,27.13 30.53,27.13 R8.1
N$12
  Bottom 0.152: R10.P$1 35.56,36.88 44.4,45.72 JP20.3
N$14
  Top 0.152: JP13.3 21.69,48.16 22.61,48.16 34.34,36.42 34.34,31.85 38,28.19 38,26.67 R11.P$1
N$15  (via drill 0.5)
  other vias: 55.88,33.66
RESET  (via drill 0.33)
  Top 0.152: v23.98,38.1 R1.1 | v30.99,40.69 36.47,40.69 39.06,38.1 | U1.29 45.31,34.75 v45.31,33.07 45.47,32.92 v48.51,32.92 | v59.64,31.85 60.25,32.46 60.25,32.92 S1.3 | 39.06,38.1 39.06,37.03 36.93,34.9 36.93,29.72 39.37,27.28 39.37,19.05 JP3.5 | 39.06,38.1 C1.2
  Bottom 0.152: v23.98,38.1 28.4,38.1 v30.99,40.69 | v45.31,33.07 45.31,24.99 JP3.5 | v59.64,31.85 52.63,31.85 51.56,32.92 v48.51,32.92
RXI  (via drill 0.33)
  Top 0.152: 48.06,37.34 48.21,37.49 48.21,38.71 48.36,38.86 49.73,38.86 52.17,36.42 53.24,36.42 R4.2 | 48.06,37.34 46.69,37.34 45.47,38.56 45.47,38.71 45.31,38.86 43.94,38.86 43.79,38.71 43.79,35.97 44.4,35.36 44.4,34.9 U1.30 | v51.26,32.31 51.26,34.14 48.06,37.34
  Bottom 0.152: v51.26,32.31 53.09,30.48 53.09,27.28 52.78,26.98 52.78,13.41 JP1.3
SCK  (via drill 0.33)
  Top 0.152: v50.04,26.82 50.04,27.58 U1.17 | R2.2 47.45,38.1 47.45,38.41 49.89,40.84 51.87,40.84 55.52,44.5 56.44,44.5 57.35,45.41 57.35,51.97 55.98,53.34 JP7.4
  Bottom 0.152: JP3.3 38.76,16 39.83,16 50.04,26.21 v50.04,26.82 50.04,28.8 47.6,31.24 47.6,35.05 54.61,42.06 54.61,52.12 55.83,53.34 JP7.4
SCL  (via drill 0.33)
  Top 0.152: JP2.4 JP9.4 JP6.4 | v13.46,12.04 6.6,5.18 R13.1 | v21.54,33.53 21.54,33.83 21.84,34.14 21.84,34.75 U3.28 | v45.47,35.97 46.08,35.36 46.08,34.9 U1.28
  Bottom 0.152: v13.46,12.04 20.78,12.04 21.54,12.8 21.54,33.07 | v21.54,33.53 21.54,33.07 | 21.54,33.07 36.02,33.07 36.78,33.83 36.78,34.75 38,35.97 v45.47,35.97 45.62,36.12 45.62,55.32 40.74,60.2 40.74,68.58 JP6.4
SCL3.3
  Top 0.152: JP5.4 JP4.4
  Bottom 0.152: JP5.4 42.72,68.58 41.5,69.8 20.17,69.8 5.08,54.71 5.08,11.73 10.26,6.55 17.88,6.55 19.25,5.18 20.32,5.18 X1.32
SDA  (via drill 0.33)
  Top 0.152: v22.91,36.58 22.91,34.9 U3.27 | v22.91,56.54 22.91,58.37 35.56,71.02 JP2.3 35.56,71.17 38,71.17 JP9.3 38.15,71.17 40.59,71.17 JP6.3 | v46.99,36.12 46.99,34.9 U1.27 | v6.45,11.28 6.45,7.62 R12.1
  Bottom 0.152: v22.91,56.54 22.91,51.97 | 22.91,51.97 v22.91,36.58 | v46.99,36.12 46.99,37.95 49.89,40.84 49.89,54.1 53.24,57.45 53.24,69.19 52.48,69.95 41.81,69.95 JP6.3 | v6.45,11.28 6.45,11.73 5.38,12.8 5.38,39.17 7.67,41.45 7.67,47.55 8.43,48.31 9.35,48.31 10.26,49.23 10.26,50.14 11.02,50.9 20.02,50.9 21.08,51.97 22.91,51.97
SDA3.3
  Top 0.152: JP5.3 52.17,71.17 54.61,71.17 JP4.3
  Bottom 0.152: X1.34 17.88,5.03 18.95,5.03 20.32,3.66 55.98,3.66 57.35,5.03 57.35,5.49 58.42,6.55 58.88,6.55 60.25,7.92 60.25,65.38 54.61,71.02 JP4.3
TXO
  Top 0.152: 52.17,23.77 52.17,16.46 55.22,13.41 JP1.2 | 52.17,23.77 52.17,24.08 52.93,24.84 53.24,24.84 R5.2 | 52.17,23.77 49.12,26.82 49.12,27.43 43.79,32.77 43.79,34.75 U1.31
VCC  (via drill 0.33)
  Top 0.152: JP2.1 JP9.1 40.59,76.2 | 40.59,76.2 55.83,60.96 | 40.59,76.2 JP6.1 | R6.2 53.39,30.79 53.39,28.8 R3.2 53.24,28.65 53.09,28.5 50.04,28.5 U1.18 49.89,28.5 48.97,28.5 v44.4,33.07 | 41.66,33.83 40.74,33.83 40.44,33.53 40.44,31.39 40.89,30.94 41.35,30.94 U1.4 | 41.66,33.83 42.11,33.83 42.42,33.53 42.42,33.22 42.72,32.92 42.72,30.02 42.11,29.41 41.5,29.41 U1.6 | 41.66,33.83 41.66,38.71 41.5,38.86 | 41.5,38.86 40.13,38.86 39.98,38.71 39.98,36.12 38.15,34.29 R11.P$2 | 16.36,30.48 16.66,30.79 17.27,30.79 U3.4 | 16.36,30.48 16.36,29.72 16.66,29.41 17.27,29.41 U3.6 | v14.38,28.35 12.7,28.35 | JP3.2 36.17,13.26 29.62,13.26 28.4,12.04 21.54,12.04 20.32,13.26 JP10.4 | 55.83,60.96 55.83,60.5 44.86,49.53 43.94,49.53 41.5,47.09 41.5,38.86 | 55.83,60.96 JP7.1 | 4.93,7.62 4.93,5.18 R13.2 | 12.7,28.35 C3.2 | 12.7,28.35 C9.2 | v16.81,36.42 16.81,38.1 R1.2 | v20.93,32.16 24.59,28.5 25.81,28.5 U3.18 | v15.75,30.48 16.36,30.48 | 4.93,7.62 4.93,11.28 JP11.2 | 4.93,7.62 R12.2
  Bottom 0.152: 39.37,33.07 v44.4,33.07 | 39.37,33.07 38.15,34.29 R11.P$2 | X1.1 57.35,7.62 52.93,12.04 51.41,12.04 51.26,12.19 | 51.26,12.19 50.19,13.26 JP1.4 | JP10.4 20.32,14.63 | 20.32,14.63 20.32,22.4 v14.38,28.35 14.38,30.48 | 20.32,14.63 9.04,14.63 7.82,13.41 7.06,13.41 JP11.2 | 51.26,12.19 47.14,8.08 47.14,5.03 46.08,3.96 45.31,3.96 44.25,5.03 44.25,5.49 43.18,6.55 42.72,6.55 41.66,7.62 41.66,8.08 36.32,13.41 JP3.2 36.17,13.41 36.17,14.17 34.95,15.39 34.95,16.31 35.87,17.22 36.78,17.22 37.54,17.98 37.54,24.38 39.37,26.21 39.37,33.07 | 16.81,34.14 v16.81,36.42 | 16.81,34.14 14.38,31.7 14.38,30.48 | v20.93,32.16 18.8,32.16 16.81,34.14 | 14.38,30.48 v15.75,30.48
VCC3.3
  Top 0.152: X1.33 18.8,7.62 22.61,11.43 57.66,11.43 59.03,12.8 59.03,71.78 JP4.1 JP5.1
VIN
  Top 1.27: U$2.2-2 U$2.2 11.35,62.31 16.51,56.52 16.51,47.62 JP13.5

### Text on the board
tPlace: 5v | 3.3v | GND | GND | GND | SDA | SDA | SCL | SCL | 3.3v / I2C | 5v I2C | VIN | VCC | GND | GND | Clk | GND | Vcc | Data | GND | GND | GND | DTR | GND | DTR | ICSP